# Altium schematic sheet ZIGBEE1.SchDoc
size A3
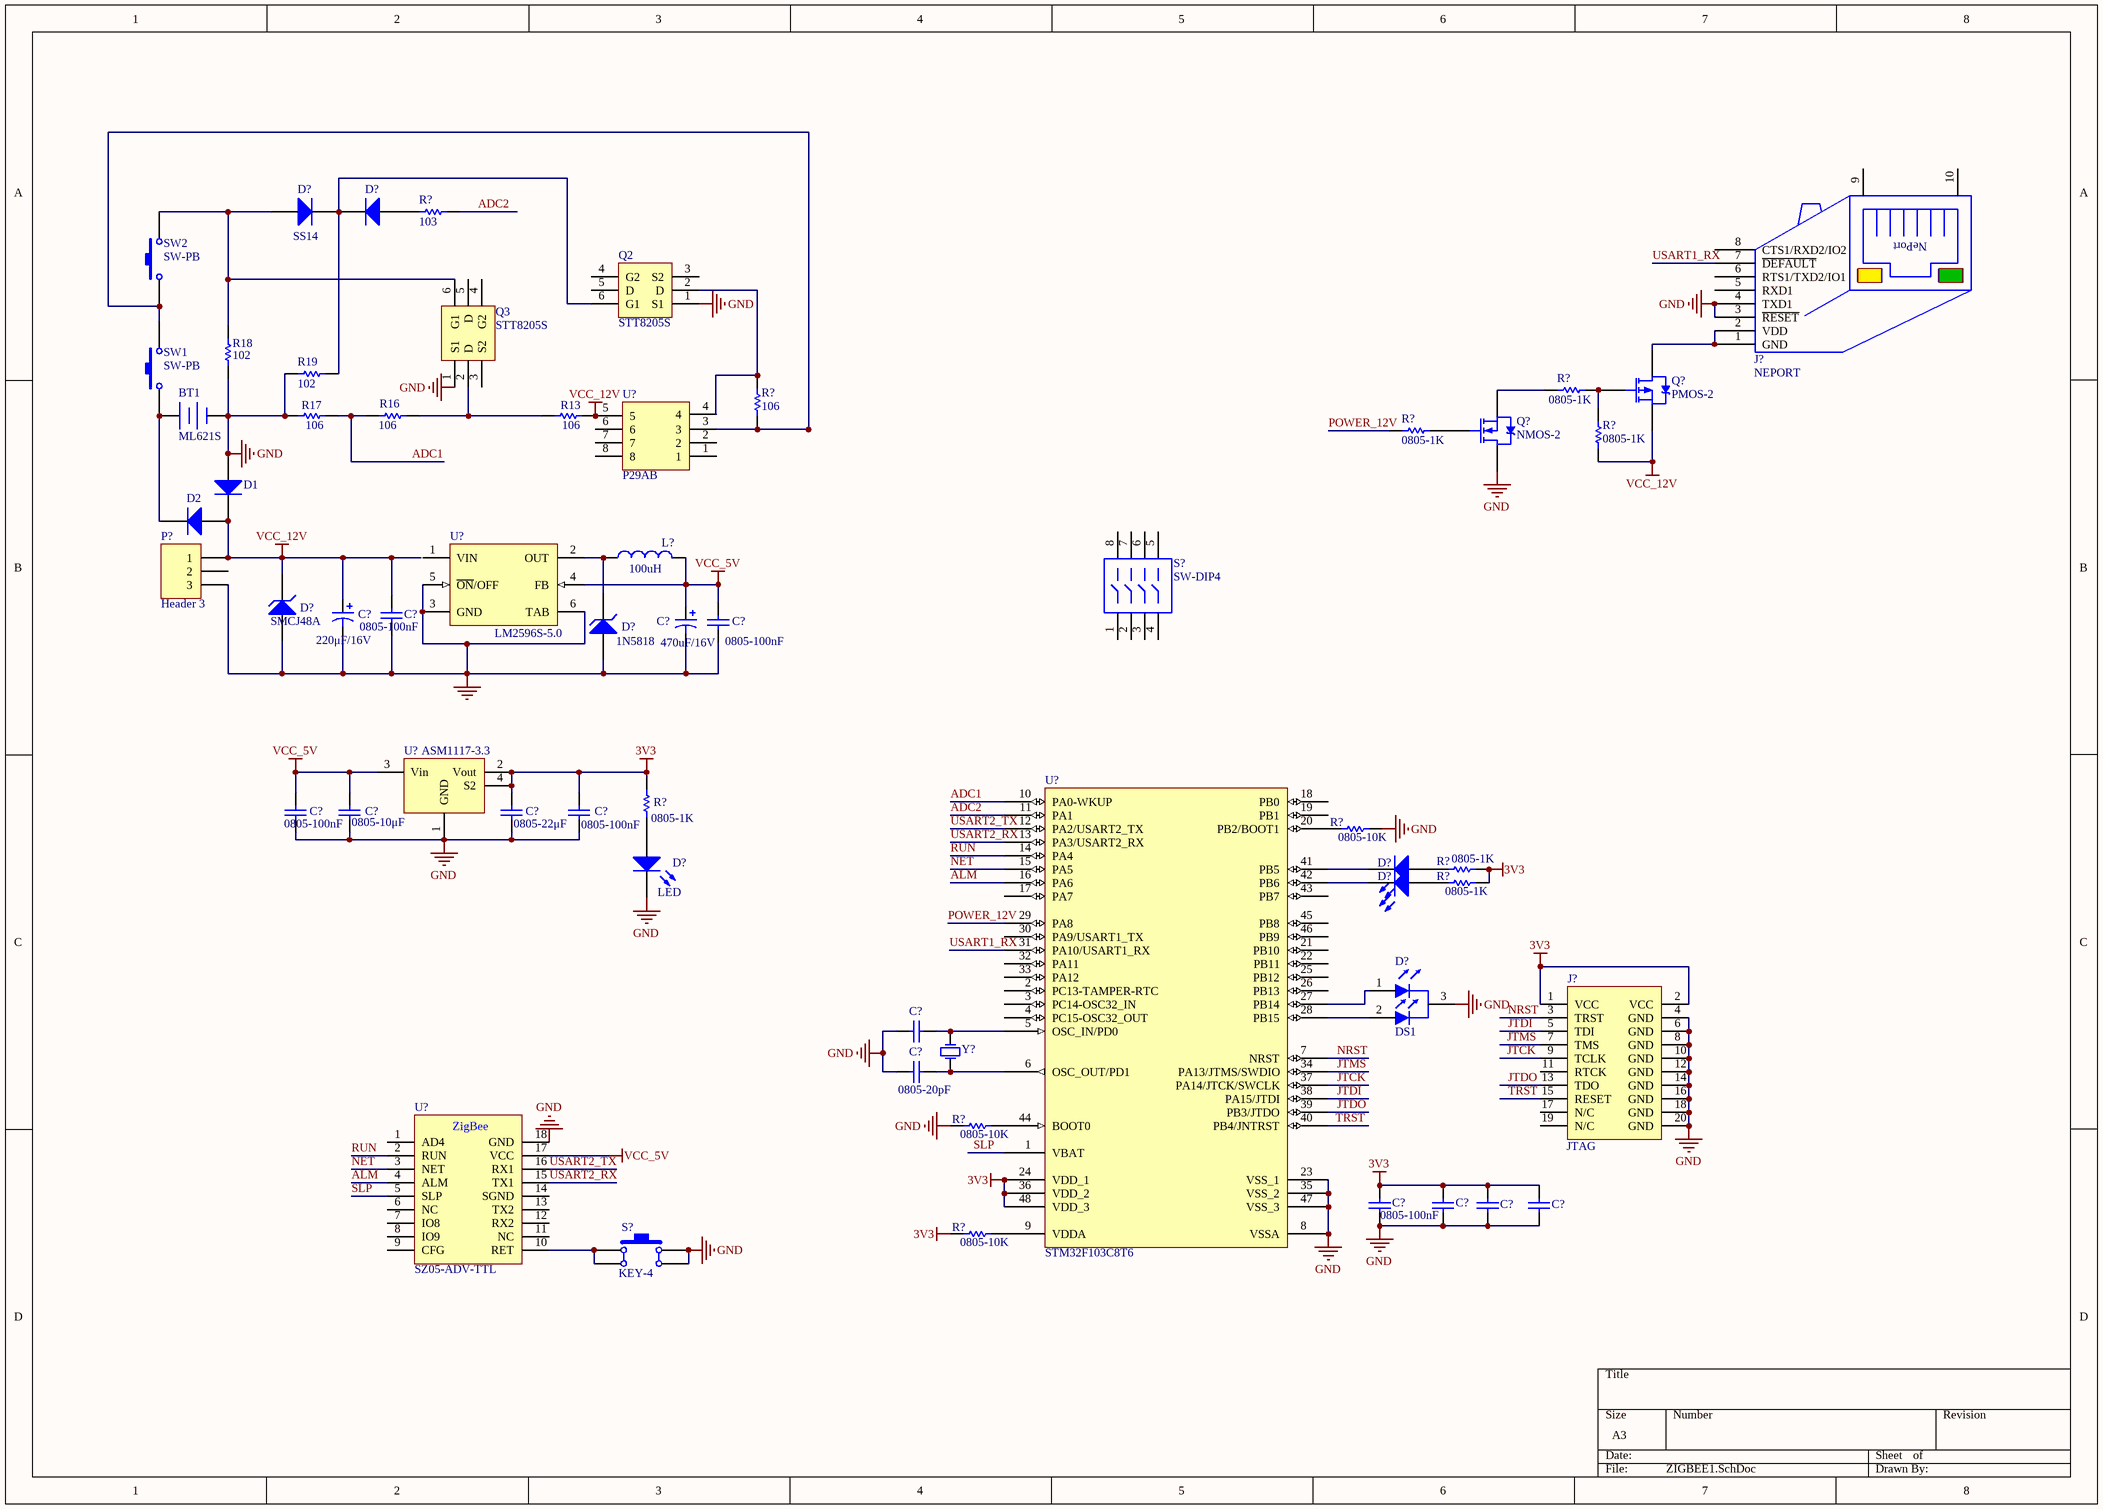
[diagram p0: ZIGBEE1.SchDoc]

## Parts
(Parts that share a designator on the sheet are numbered #1, #2 ... from top to bottom, then left to right.)
BT1  ML621S  [TJC3-2A]
C?#1  220μF/16V  [SMD-EC]
C?#2  0805-100nF  [0805C]
C?#3  470uF/16V  [SMD-EC]
C?#4  0805-100nF  [0805C]
C?#5  0805-22μF  [C0805]
C?#6  0805-100nF  [0805c]
C?#7  0805-10μF  [C0805]
C?#8  0805-100nF  [0805c]
C?#9  0805-20pF  [0805C]  (value not drawn)
C?#10  0805-20pF  [0805C]
C?#11  0805-100nF  [0805C]
C?#12  0805-100nF  [0805C]  (value not drawn)
C?#13  0805-100nF  [0805C]  (value not drawn)
C?#14  0805-100nF  [0805C]  (value not drawn)
D1  Diode 1N4001  [DO-41]  (value not drawn)
D2  Diode 1N4001  [DO-41]  (value not drawn)
D?#1  SS14  [DO-214AC]
D?#2  Diode 1N4001  [DO-41]  (value not drawn)
D?#3  SMCJ48A  [SMcj]
D?#4  1N5818  [DO-214AC]
D?#5  LED  [0805D]
D?#6  LED  [0805D]  (value not drawn)
D?#7  LED  [0805D]  (value not drawn)
D?#8  DS1
J?#1  NEPORT  [NEPORT-8P]
J?#2  JTAG  [HDR2X10]
L?  value 100uH  [IND-12]  (hidden comment: 101uH电感)
P?  Header 3  [XH-2.54-3]
Q2  STT8205S
Q3  STT8205S
Q?#1  PMOS-2  [TO-220AB]
Q?#2  NMOS-2  [TO-220AB]
R13  106  [0805]
R16  106  [0805]
R17  106  [0805]
R18  102  [0805]
R19  102  [0805]
R?#1  103  [0805]
R?#2  106  [0805]
R?#3  0805-1K  [0805]
R?#4  0805-1K  [0805]
R?#5  0805-1K  [0805]
R?#6  0805-1K  [0805]
R?#7  0805-10K  [0805]
R?#8  0805-1K  [0805]
R?#9  0805-1K  [0805]
R?#10  0805-10K  [0805]
R?#11  0805-10K  [0805]
S?#1  SW-DIP4  [DIP-8]
S?#2  KEY-4
SW1  SW-PB  [XH-2.54-2]
SW2  SW-PB  [HDR1X2]
U?#1  P29AB
U?#2  LM2596S-5.0  [TS5B_N]
U?#3  ASM1117-3.3  [SOT233]
U?#4  STM32F103C8T6  [LQFP48_N]
U?#5  SZ05-ADV-TTL
Y?  8MHz  [XTAL]  (value not drawn)

## Nets
3V3: C?#5.1 C?#8.2 C?#11.2 C?#12.2 C?#13.2 C?#14.2 J?#2.1(VCC) J?#2.2(VCC) R?#6.2 R?#8.2 R?#9.2 R?#11.1 U?#3.2(Vout) U?#3.4(S2) U?#4.24(VDD_1) U?#4.36(VDD_2) U?#4.48(VDD_3)
GND: BT1.1(-) C?#1.2 C?#2.1 C?#3.2 C?#4.1 C?#5.2 C?#6.1 C?#7.1 C?#8.1 C?#9.1 C?#10.1 C?#11.1 C?#12.1 C?#13.1 C?#14.1 D1.1(A) D?#3.1(A) D?#4.1(A) D?#5.2(K) D?#8.3 J?#1.3(~{RESET}) J?#1.4(TXD1) J?#2.4(GND) J?#2.6(GND) J?#2.8(GND) J?#2.10(GND) J?#2.12(GND) J?#2.14(GND) J?#2.16(GND) J?#2.18(GND) J?#2.20(GND) P?.3 Q2.1(S1) Q3.1(S1) Q?#2.2(D) R17.2 R18.2 R19.1 R?#7.2 R?#10.1 S?#2.3 S?#2.4 U?#2.3(GND) U?#2.5(~{ON}/OFF) U?#2.6(TAB) U?#3.1(GND) U?#4.8(VSSA) U?#4.23(VSS_1) U?#4.35(VSS_2) U?#4.47(VSS_3) U?#5.18(GND)
VCC_5V: C?#3.1 C?#4.2 C?#6.2 C?#7.2 L?.2 U?#2.4(FB) U?#3.3(Vin) U?#5.17(VCC)
VCC_12V: C?#1.1 C?#2.2 D1.2(K) D2.1(A) D?#3.2(K) P?.1 Q?#1.3(S) R13.1 R?#4.2 U?#1.5
ADC1: R16.2 R17.1 U?#4.10(PA0-WKUP)
ADC2: R?#1.2 U?#4.11(PA1)
ALM: U?#4.16(PA6) U?#5.4(ALM)
JTCK: J?#2.9(TCLK) U?#4.37(PA14/JTCK/SWCLK)
JTDI: J?#2.5(TDI) U?#4.38(PA15/JTDI)
JTDO: J?#2.13(TDO) U?#4.39(PB3/JTDO)
JTMS: J?#2.7(TMS) U?#4.34(PA13/JTMS/SWDIO)
NET: U?#4.15(PA5) U?#5.3(NET)
NRST: J?#2.3(TRST) U?#4.7(NRST)
POWER_12V: R?#5.2 U?#4.29(PA8)
RUN: U?#4.14(PA4) U?#5.2(RUN)
SLP: U?#4.1(VBAT) U?#5.5(SLP)
TRST: J?#2.15(RESET) U?#4.40(PB4/JNTRST)
USART1_RX: J?#1.7(~{DEFAULT}) U?#4.31(PA10/USART1_RX)
USART2_RX: U?#4.13(PA3/USART2_RX) U?#5.15(TX1)
USART2_TX: U?#4.12(PA2/USART2_TX) U?#5.16(RX1)
NetBT1_2: BT1.2(+) D2.2(K) SW1.1
NetC?#9_2: C?#9.2 U?#4.5(OSC_IN/PD0) Y?.2(OSC2)
NetC?#10_2: C?#10.2 U?#4.6(OSC_OUT/PD1) Y?.1(OSC1)
NetD?#1_1: D?#1.1(A) Q3.6(G1) R18.1 SW2.2
NetD?#1_2: D?#1.2(K) D?#2.2(K) Q2.6(G1) R19.2
NetD?#2_1: D?#2.1(A) R?#1.1
NetD?#4_2: D?#4.2(K) L?.1 U?#2.2(OUT)
NetD?#5_1: D?#5.1(A) R?#6.1
NetD?#6_1: D?#6.1(A) R?#8.1
NetD?#6_2: D?#6.2(K) U?#4.41(PB5)
NetD?#7_1: D?#7.1(A) R?#9.1
NetD?#7_2: D?#7.2(K) U?#4.42(PB6)
NetD?#8_1: D?#8.1 U?#4.27(PB14)
NetD?#8_2: D?#8.2 U?#4.28(PB15)
NetJ?#1_1: J?#1.1(GND) J?#1.2(VDD) Q?#1.2(D)
NetQ2_2: Q2.2(D) R?#2.1 U?#1.4
NetQ3_2: Q3.2(D) R13.2 R16.1
NetQ?#1_1: Q?#1.1(G) R?#3.1 R?#4.1
NetQ?#2_1: Q?#2.1(G) R?#5.1
NetQ?#2_3: Q?#2.3(S) R?#3.2
NetR?#2_2: R?#2.2 SW1.2 SW2.1 U?#1.3
NetR?#7_1: R?#7.1 U?#4.20(PB2/BOOT1)
NetR?#10_2: R?#10.2 U?#4.44(BOOT0)
NetR?#11_2: R?#11.2 U?#4.9(VDDA)
NetS?#2_1: S?#2.1 S?#2.2 U?#5.10(RET)

Not connected (* = marked no-connect by the designer): J?#1 5(RXD1) 6(RTS1/TXD2/IO1) 8(CTS1/RXD2/IO2) 9(SHELL) 10(SHELL); J?#2 11(RTCK) 17(N/C) 19(N/C); P? 2; Q2 3(S2) 4(G2) 5(D); Q3 3(S2) 4(G2) 5(D); S?#1 1 2 3 4 5 6 7 8; U?#1 1 2 6 7 8; U?#2 1(VIN); U?#4 2(PC13-TAMPER-RTC) 3(PC14-OSC32_IN) 4(PC15-OSC32_OUT) 17(PA7) 18(PB0) 19(PB1) 21(PB10) 22(PB11) 25(PB12) 26(PB13) 30(PA9/USART1_TX) 32(PA11) 33(PA12) 43(PB7) 45(PB8) 46(PB9); U?#5 1(AD4) 6(NC) 7(IO8) 8(IO9) 9(CFG) 11(NC) 12(RX2) 13(TX2) 14(SGND)

## Notes on the sheet
- (in symbol NEPORT) NePort
- (in symbol SZ05-ADV-TTL) ZigBee

## Library data of the parts
BT1 = Battery: Multicell Battery; Published: 24-Mar-1999; LatestRevisionDate: 17-Jul-2002; LatestRevisionNote: Re-released for DXP Platform.; PackageReference: BAT-2; Publisher: Altium Limited
C?#1 = Cap Pol1: Polarized Capacitor (Radial); Published: 8-Jun-2000; LatestRevisionDate: 17-Jul-2002; LatestRevisionNote: Re-released for DXP Platform.; PackageReference: RB7.6-15; Publisher: Altium Limited; Value: 220μF/16V
C?#2 C?#4 C?#6 C?#8 = Cap Semi: Capacitor (Semiconductor SIM Model); Published: 8-Jun-2000; LatestRevisionDate: 29-May-2009; LatestRevisionNote: IPC-7351 Footprint Added.; PackageReference: C1206; Publisher: Altium Limited; PackageDescription: Chip Capacitor; Value: 0805-100nF
C?#3 = Cap Pol1: Polarized Capacitor (Radial); Value: 470μF/16v; Published: 8-Jun-2000; LatestRevisionDate: 17-Jul-2002; LatestRevisionNote: Re-released for DXP Platform.; PackageReference: RB7.6-15; Publisher: Altium Limited
C?#5 C?#7 C?#9-C?#14 = Cap: Capacitor; Published: 8-Jun-2000; LatestRevisionDate: 17-Jul-2002; LatestRevisionNote: Re-released for DXP Platform.; PackageReference: RAD-0.3; Publisher: Altium Limited
  C?#5: Value: 0805-22μF
  C?#7: Value: 0805-10μF
  C?#9 C?#10: PackageDescription: Radial Cap, Thru-Hole; 2 Leads; 0.3 in Pin Spacing; Value: 0805-20pF
  C?#11-C?#14: PackageDescription: Radial Cap, Thru-Hole; 2 Leads; 0.3 in Pin Spacing; Value: 0805-100nF
D1 D2 D?#1 D?#2 = Diode 1N4001: 1 Amp General Purpose Rectifier; Published: 8-Jun-2000; LatestRevisionDate: 17-Jul-2002; LatestRevisionNote: Re-released for DXP Platform.; DatasheetDocument: 1998; PackageDocument: Aug-1999; PackageReference: DO-41; Publisher: Altium Limited; Code_JEDEC: DO-204-AL; ComponentLink1Description: Manufacturer Link; ComponentLink1URL: http://www.fairchildsemi.com/; ComponentLink2Description: Datasheet; ComponentLink2URL: http://www.fairchildsemi.com/ds/1N%2F1N4001.pdf
D?#3 = D Zener: Zener Diode; Published: 8-Jun-2000; LatestRevisionDate: 17-Jul-2002; LatestRevisionNote: Re-released for DXP Platform.; PackageReference: DIODE-0.7; Publisher: Altium Limited
D?#4 = 1N4750A: One Watt Zener; Published: 8-Jun-2000; LatestRevisionDate: 17-Jul-2002; LatestRevisionNote: Re-released for DXP Platform.; DatasheetDocument: 1997; PackageDocument: Aug-1999; PackageReference: DO-41; Publisher: Altium Limited; Code_JEDEC: DO-204-AL; ComponentLink1Description: Manufacturer Link; ComponentLink1URL: http://www.fairchildsemi.com/; ComponentLink2Description: Datasheet; ComponentLink2URL: http://www.fairchildsemi.com/ds/1N%2F1N4728A.pdf
D?#5-D?#7 = LED0: Typical INFRARED GaAs LED; Published: 8-Jun-2000; LatestRevisionDate: 08-Jul-2005; LatestRevisionNote: Mech Layer 1 removed.; PackageReference: LED-0; Publisher: Altium Limited
J?#1 = NEPORT: serial to ethernet RJ45 jack
J?#2 = J-LINK
L? = Inductor: Code_IEC: 1005; Published: 8-Jun-2000; LatestRevisionDate: 17-Jul-2002; LatestRevisionNote: Re-released for DXP Platform.; PackageReference: 0402-A; Publisher: Altium Limited; Code_JEITA: 0402
P? = Header 3: Header, 3-Pin; LatestRevisionDate: 17-Jul-2002; LatestRevisionNote: Re-released for DXP Platform.; Publisher: Altium Limited
Q?#1 = PMOS-2: P-Channel Power MOSFET; Note: Pin 4 not drawn and electrically connected to Pin 2.; Published: 8-Jun-2000; LatestRevisionDate: 17-Jul-2002; LatestRevisionNote: Re-released for DXP Platform.; DatasheetDocument: PD-9.390D; PackageReference: TO-220AB; Publisher: Altium Limited; Code_JEDEC: TO-220-AB; ComponentLink1Description: Manufacturer Link; ComponentLink1URL: http://www.irf.com/
Q?#2 = NMOS-2: N-Channel Power MOSFET; Note: Pin 2 is electrically connected to pin 4.; Published: 8-Jun-2000; LatestRevisionDate: 17-Jul-2002; LatestRevisionNote: Re-released for DXP Platform.; DatasheetDocument: PD-9.814; PackageReference: TO-220AB; Publisher: Altium Limited; Code_JEDEC: TO-220-AB; ComponentLink1Description: Manufacturer Link; ComponentLink1URL: http://www.irf.com/
R13 R16-R19 R?#1 R?#2 = Res Semi: Semiconductor Resistor; Value: 0805-1K; Published: 8-Jun-2000; LatestRevisionDate: 17-Jul-2002; LatestRevisionNote: Re-released for DXP Platform.; PackageReference: AXIAL-0.5; Publisher: Altium Limited
R?#3-R?#11 = Res Semi: Semiconductor Resistor; Published: 8-Jun-2000; LatestRevisionDate: 17-Jul-2002; LatestRevisionNote: Re-released for DXP Platform.; PackageReference: AXIAL-0.5; Publisher: Altium Limited
  R?#3-R?#6 R?#8 R?#9: Value: 0805-1K
  R?#7 R?#10 R?#11: Value: 0805-10K
S?#1 = SW-DIP4: DIP Switch; Published: 24-Mar-1999; LatestRevisionDate: 17-Jul-2002; LatestRevisionNote: Re-released for DXP Platform.; PackageReference: DIP-8; Publisher: Altium Limited
SW1 SW2 = SW-PB: Switch; Published: 24-Mar-1999; LatestRevisionDate: 17-Jul-2002; LatestRevisionNote: Re-released for DXP Platform.; PackageReference: SPST-2; Publisher: Altium Limited
U?#2 = LM2596S-5.0: SIMPLE SWITCHER Power Converter 150 KHz 3A Step-Down Voltage Regulator; Manufacturer: National Semiconductor; PackageTopMarking: NSUZXYTT*LM2596S*-5.0 P+; Published: 4-Dec-2008; PackageVersion: revD, Apr-2005; PackageReference: TS5B; Publisher: Altium Limited; PackageDescription: TO-263, Molded, .400 x .390 x .180in, 5 Lead, .067in Pitch, Surface Mount; CompType: Switcher; PartNumber: LM2596S-5.0; RoHS: O; PinCount: 5; DigiKeyPartNumber: LM2596S-5.0-ND; Code_JEDEC: MO-169-AB; ComponentLink1Description: LM2596 Datasheet; ComponentLink1URL: http://www.national.com/ds/LM/LM2596.pdf; ComponentLink2Description: LM2596 Web Page; ComponentLink2URL: http://www.national.com/pf/LM/LM2596.html; ComponentLink3Description: TS5B Package Page; ComponentLink3URL: http://www.national.com/packaging/folders/ts5b.html
U?#3 = ASM1117
U?#4 = STM32F103C8T6: STM32 ARM-based 32-bit MCU with 64 Kbytes Flash, 48-pin LQFP, Industrial Temperature; Published: 30-May-2008; DatasheetVersion: rev6, Mar-2008; PackageVersion: Mar-2008; PackageReference: LQFP48; Publisher: Altium Limited; PackageDescription: 48-Pin Low-Profile Quad Flat Pack, 7 x 7 mm Body, 0.5 mm Pitch (LQFP48); ComponentLink1Description: Manufacturer Link; ComponentLink1URL: www.st.com/stm32; ComponentLink2Description: Datasheet; ComponentLink2URL: http://www.st.com/stonline/products/literature/ds/13587.pdf
Y? = XTAL: Crystal Oscillator; Published: 8-Jun-2000; LatestRevisionDate: 17-Jul-2002; LatestRevisionNote: Re-released for DXP Platform.; PackageReference: R38; Publisher: Altium Limited; PackageDescription: Crystal, Thru-Hole; 2 Leads; Body 3.1 x 8.2 mm (Dia.xH)